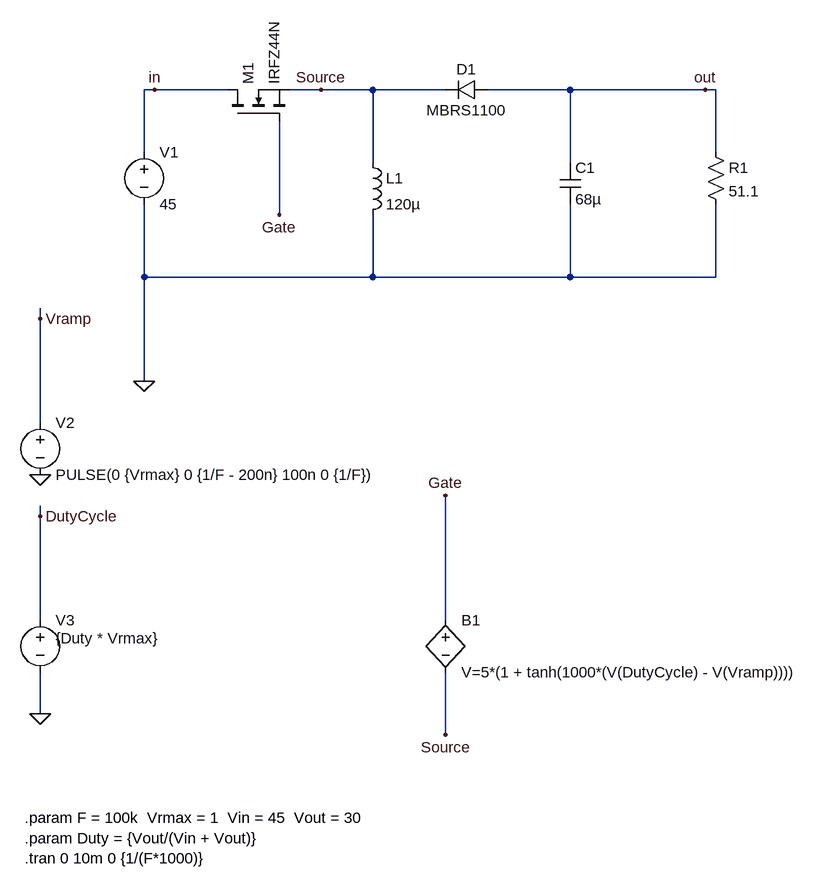
[diagram p0: schematic Draft1.asc]
Draft1.asc, the LTspice schematic file:
Version 4.1
SHEET 1 1060 1304
WIRE 0 112 -16 112
WIRE 112 112 0 112
WIRE 256 112 208 112
WIRE 336 112 256 112
WIRE 448 112 336 112
WIRE 640 112 512 112
WIRE 848 112 640 112
WIRE 864 112 848 112
WIRE -16 208 -16 112
WIRE 864 208 864 112
WIRE 336 224 336 112
WIRE 640 224 640 112
WIRE 192 304 192 160
WIRE -16 400 -16 288
WIRE 336 400 336 304
WIRE 336 400 -16 400
WIRE 640 400 640 288
WIRE 640 400 336 400
WIRE 864 400 864 288
WIRE 864 400 640 400
WIRE -176 464 -176 448
WIRE -16 560 -16 400
WIRE -176 624 -176 464
WIRE -176 768 -176 752
WIRE -176 928 -176 768
WIRE 448 928 448 736
WIRE -176 1072 -176 1008
WIRE 448 1104 448 1008
FLAG -16 560 0
FLAG 192 304 Gate
FLAG 256 112 Source
FLAG 0 112 in
FLAG 848 112 out
FLAG -176 704 0
FLAG -176 1072 0
FLAG -176 464 Vramp
FLAG -176 768 DutyCycle
FLAG 448 1104 Source
FLAG 448 736 Gate
SYMBOL voltage -16 192 R0
WINDOW 123 0 0 Left 0
WINDOW 39 0 0 Left 0
SYMATTR InstName V1
SYMATTR Value 45
SYMBOL nmos 112 160 R270
SYMATTR InstName M1
SYMATTR Value IRFZ44N
SYMBOL diode 512 96 R90
WINDOW 0 0 32 VBottom 2
WINDOW 3 32 32 VTop 2
SYMATTR InstName D1
SYMATTR Value MBRS1100
SYMATTR Description Diode
SYMATTR Type diode
SYMBOL ind 320 208 R0
SYMATTR InstName L1
SYMATTR Value 120µ
SYMATTR SpiceLine Ipk=0.6 Rser=0.599 Rpar=119100 Cpar=2.84p mfg="Bourns, Inc." pn="SDE0604A-121K"
SYMBOL cap 624 224 R0
WINDOW 3 24 56 Left 2
SYMATTR InstName C1
SYMATTR Value 68µ
SYMATTR Description Capacitor
SYMATTR Type cap
SYMATTR SpiceLine V=6.3 Irms=0 Rser=0.9 Lser=0 mfg="AVX" pn="TAJD686M006" type="Tantalum"
SYMBOL res 848 192 R0
SYMATTR InstName R1
SYMATTR Value 51.1
SYMATTR SpiceLine tol=1 pwr=0.1
SYMBOL voltage -176 608 R0
WINDOW 123 0 0 Left 0
WINDOW 39 0 0 Left 0
SYMATTR InstName V2
SYMATTR Value PULSE(0 {Vrmax} 0 {1/F - 200n} 100n 0 {1/F})
SYMBOL voltage -176 912 R0
WINDOW 3 24 44 Left 2
WINDOW 123 0 0 Left 0
WINDOW 39 0 0 Left 0
SYMATTR InstName V3
SYMATTR Value {Duty * Vrmax}
SYMBOL bv 448 912 R0
SYMATTR InstName B1
SYMATTR Value V=5*(1 + tanh(1000*(V(DutyCycle) - V(Vramp))))
TEXT -200 1232 Left 2 !.param F = 100k  Vrmax = 1  Vin = 45  Vout = 30\n.param Duty = {Vout/(Vin + Vout)}\n.tran 0 10m 0 {1/(F*1000)}

The netlist it stands for:
* Draft1.asc
V1 in 0 45
M1 in Gate Source Source IRFZ44N
D1 out Source MBRS1100
L1 Source 0 120µ Ipk=0.6 Rser=0.599 Rpar=119100 Cpar=2.84p mfg="Bourns, Inc." pn="SDE0604A-121K"
C1 out 0 68µ V=6.3 Irms=0 Rser=0.9 Lser=0 mfg="AVX" pn="TAJD686M006" type="Tantalum"
R1 out 0 51.1 tol=1 pwr=0.1
V2 Vramp 0 PULSE(0 {Vrmax} 0 {1/F - 200n} 100n 0 {1/F})
V3 DutyCycle 0 {Duty * Vrmax}
B1 Gate Source V=5*(1 + tanh(1000*(V(DutyCycle) - V(Vramp))))
.model D D
.lib standard.dio
.model NMOS NMOS
.model PMOS PMOS
.lib standard.mos
.param F = 100k  Vrmax = 1  Vin = 45  Vout = 30
.param Duty = {Vout/(Vin + Vout)}
.tran 0 10m 0 {1/(F*1000)}
.backanno
.end